# EasyEDA Pro project FD-MIE-B.eprj

# Schematic FD-MIE-B1
Create Date: 2025-06-20; Page Name: P1; Project Name: FD-MIE-B; Schematic Name: FD-MIE-B1; Update Date: 2025-06-23; Company: 嘉立创EDA; Page Size: A4; Version: V1.0
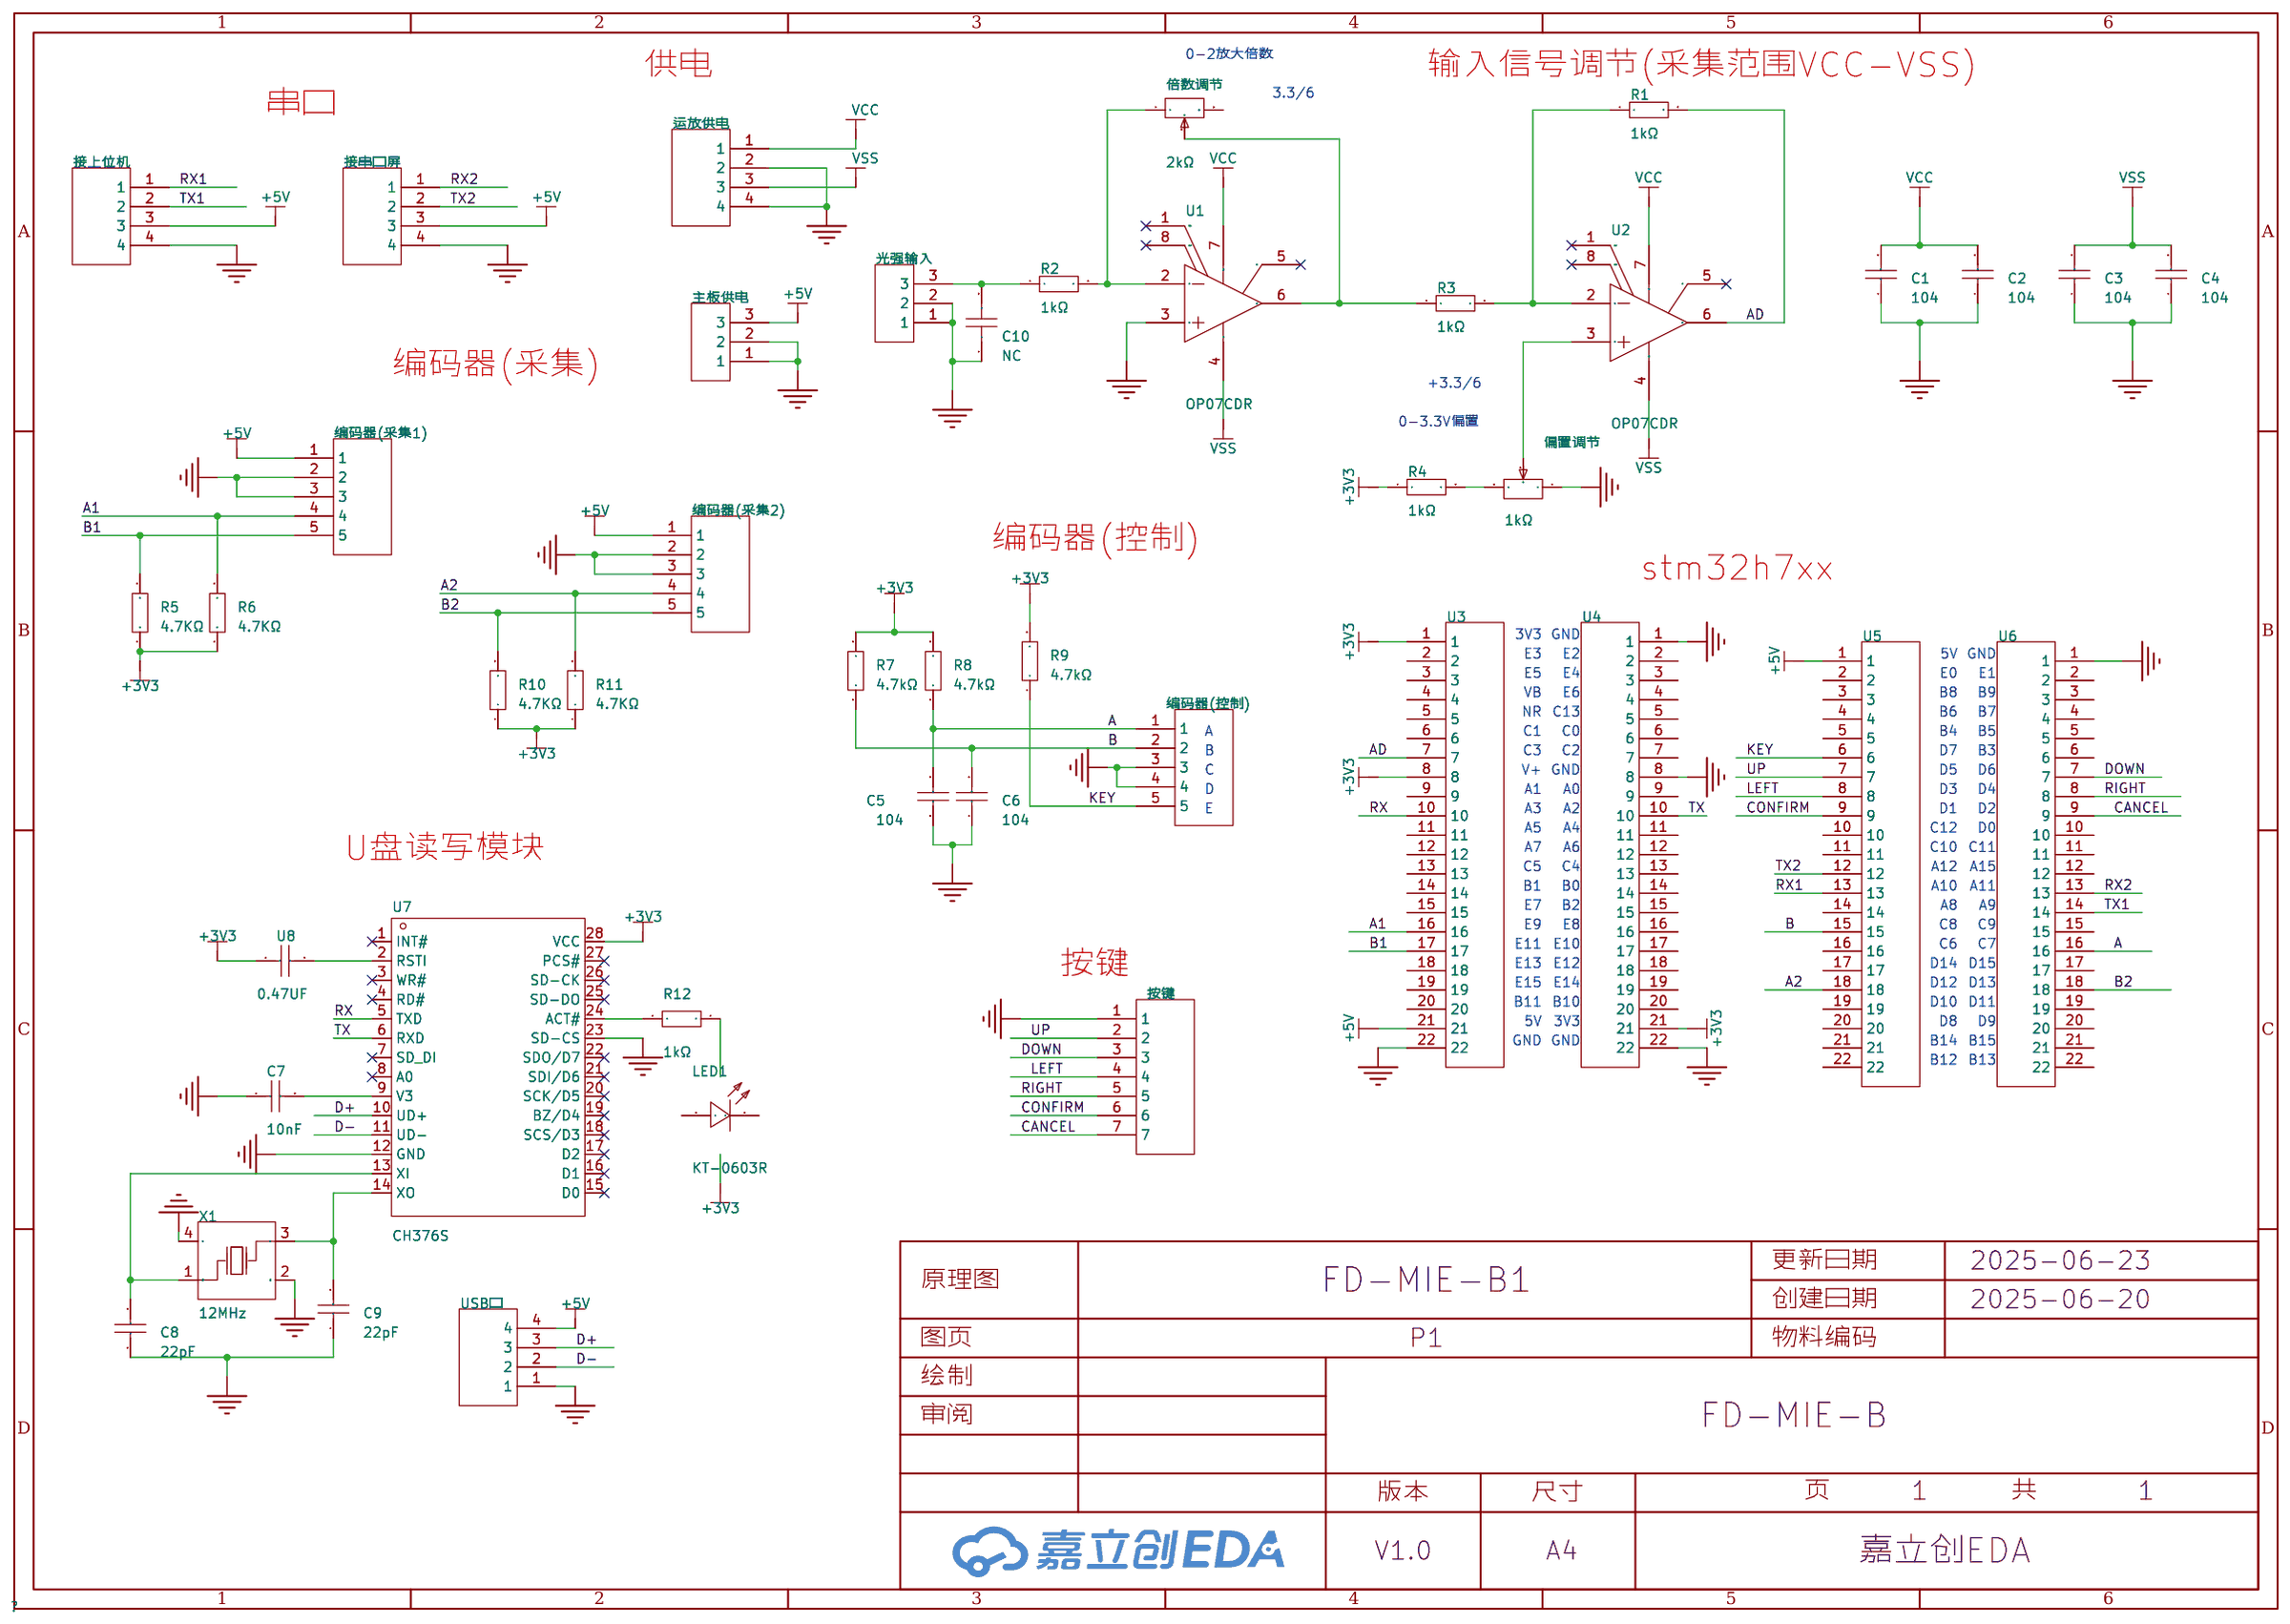
[diagram p0: schematic sheet]

## Parts
C1  104  [C0603]
C2  104  [C0603]
C3  104  [C0603]
C4  104  [C0603]
C5  104  [C0603]
C6  104  [C0603]
C7  10nF  [C0603]
C8  22pF  [C0603]
C9  22pF  [C0603]
C10  NC  [280*100mil]
LED1  KT-0603R  [LED0603-RD]
R1  1kΩ  [R0603]
R2  1kΩ  [R0603]
R3  1kΩ  [R0603]
R4  1kΩ  [R0603]
R5  4.7KΩ  [R0805]
R6  4.7KΩ  [R0805]
R7  4.7kΩ  [R0805]
R8  4.7kΩ  [R0805]
R9  4.7kΩ  [R0805]
R10  4.7KΩ  [R0805]
R11  4.7KΩ  [R0805]
R12  1kΩ  [R0603]
U1  OP07CDR  [SOIC-8_L4.9-W3.9-P1.27-LS6.0-BL]
U2  OP07CDR  [SOIC-8_L4.9-W3.9-P1.27-LS6.0-BL]
U3  -  [CH2.54-22P]
U4  -  [CH2.54-22P]
U5  -  [CH2.54-22P]
U6  -  [CH2.54-22P]
U7  CH376S  [SOIC-28_L17.9-W7.5-P1.27-LS10.3-BL]
U8  0.47UF  [C0603]
USB口  -  [CH2.54-4插座]
X1  12MHz  [CRYSTAL-SMD_4P-L3.2-W2.5-BL]
主板供电  -  [CH2.54-3插座]
倍数调节  2kΩ  [RES-ADJ-TH_3P-L9.5-W4.9-P2.50]
偏置调节  1kΩ  [RES-ADJ-TH_3P-L9.5-W4.9-P2.50]
光强输入  -  [CH2.54-3插座]
按键  -  [CH2.54-7插座]
接上位机  -  [CH2.54-4插座]
接串口屏  -  [CH2.54-4插座]
编码器(控制)  -  [CH2.54-5插座]
编码器(采集1)  -  [CH2.54-5插座]
编码器(采集2)  -  [CH2.54-5插座]
运放供电  -  [CH2.54-4插座]

## Library data of the parts
C1-C7 = 0603B103K500NT: 容值:10nF;精度:±10%;额定电压:50V;材质(温度系数):X7R;; LCSC Part Name: 10nF ±10% 50V; Supplier Part: C57112; Manufacturer: FH(风华); Supplier Footprint: 0603; JLCPCB Part Class: 基础库; Datasheet: https://atta.szlcsc.com/upload/public/pdf/source/20200305/C486355_26A10D38EF8C2A5C37091D0039909270.pdf; Supplier: LCSC; Tolerance: ±10%; Voltage Rated: 50V; Temperature Coefficient: X7R
C8 C9 = CL10C220JB8NNNC: 容值:22pF;精度:±5%;额定电压:50V;材质(温度系数):C0G;; LCSC Part Name: 22pF ±5% 50V; Supplier Part: C1653; Manufacturer: SAMSUNG(三星); Supplier Footprint: 0603; JLCPCB Part Class: 基础库; Datasheet: https://atta.szlcsc.com/upload/public/pdf/source/20160218/1457707763339.pdf; Supplier: LCSC; Tolerance: ±5%; Voltage Rated: 50V; Temperature Coefficient: C0G
C10 = 插件电容
LED1 = KT-0603R: 发光颜色:红色;功率:-;正向电流:-;主波长:-;二极管配置:-;透镜颜色:-;色温:-;发光角度:-;载带方式:-;工作温度:-40℃~+85℃;; LCSC Part Name: 0603 红灯 高亮; Supplier Part: C2286; Manufacturer: KENTO; Supplier Footprint: 0603; JLCPCB Part Class: 基础库; Datasheet: https://atta.szlcsc.com/upload/public/pdf/source/20160616/1466072038404.pdf; Supplier: LCSC; Emitted Color: 红色; Operating Temperature: -40℃~+85℃
R1-R4 = 0603WAF510KT5E: 电阻类型:厚膜电阻;阻值:5.1Ω;精度:±1%;功率:100mW;最大工作电压:75V;温度系数:±200ppm/℃;; LCSC Part Name: 5.1Ω ±1% 100mW 厚膜电阻; Supplier Part: C25197; Manufacturer: UNI-ROYAL(厚声); Supplier Footprint: 0603; JLCPCB Part Class: 基础库; Datasheet: https://atta.szlcsc.com/upload/public/pdf/source/20200306/C422600_1E6D84923E4A46A82E41ADD87F860B5C.pdf; Supplier: LCSC; Type: 厚膜电阻; Tolerance: ±1%; Power(Watts): 100mW; Overload Voltage (Max): 75V; Temperature Coefficient: ±200ppm/℃; Operating Temperature Range: -55℃~+155℃
R5-R11 = 0805W8F1002T5E_C17414: 电阻类型:厚膜电阻;阻值:10kΩ;精度:±1%;功率:125mW;最大工作电压:150V;温度系数:±100ppm/℃;; LCSC Part Name: 10kΩ ±1% 125mW 厚膜电阻; Supplier Part: C17414; Manufacturer: UNI-ROYAL(厚声); Manufacturer Part: 0805W8F1002T5E; Supplier Footprint: 0805; JLCPCB Part Class: 基础库; Datasheet: https://atta.szlcsc.com/upload/public/pdf/source/20200306/C422600_1E6D84923E4A46A82E41ADD87F860B5C.pdf; Supplier: LCSC; Type: 厚膜电阻; Tolerance: ±1%; Power(Watts): 125mW; Overload Voltage (Max): 150V; Temperature Coefficient: ±100ppm/℃; Operating Temperature Range: -55℃~+155℃
R12 = 0603WAF1001T5E: 电阻类型:厚膜电阻;阻值:1kΩ;精度:±1%;功率:100mW;最大工作电压:75V;温度系数:±100ppm/℃;; LCSC Part Name: 1kΩ ±1% 100mW 厚膜电阻; Supplier Part: C21190; Manufacturer: UNI-ROYAL(厚声); Supplier Footprint: 0603; JLCPCB Part Class: 基础库; Datasheet: https://atta.szlcsc.com/upload/public/pdf/source/20200306/C422600_1E6D84923E4A46A82E41ADD87F860B5C.pdf; Supplier: LCSC; Type: 厚膜电阻; Tolerance: ±1%; Power(Watts): 100mW; Overload Voltage (Max): 75V; Temperature Coefficient: ±100ppm/℃; Operating Temperature Range: -55℃~+155℃
U1 U2 = OP07CDR: 放大器数:单路;增益带宽积(GBP):600kHz;输入偏置电流(Ib):1.8nA;压摆率(SR):0.3V/us;轨到轨:-;; LCSC Part Name: 精密运算放大器; Supplier Part: C7433; Manufacturer: TI(德州仪器); Supplier Footprint: SOIC-8; JLCPCB Part Class: 基础库; Datasheet: http://www.ti.com/cn/lit/gpn/op07c; Supplier: LCSC; Number of Channels: 单路; Gain Bandwidth Product: 600kHz; Ib - Input Bias Current: 1.8nA; Slew Rate: 0.3V/us; Operating Temperature: 0℃~+70℃
U3-U6 = HDR-22P
U7 = CH376S: 应用功能:收发器;接口协议:USB 2.0;数据速率:12Mbps;; Supplier Part: C14166; Manufacturer: WCH(南京沁恒); Supplier Footprint: SOP-28-300mil; JLCPCB Part Class: 扩展库; Datasheet: https://atta.szlcsc.com/upload/public/pdf/source/20240313/780B8519D8DF2DCF0D579C39FFA4C063.pdf; Supplier: LCSC; Applications Function: 收发器; Protocol: USB 2.0; Supply Voltage: 3.3V；5V; Data Rate: 12Mbps
U8 = CAPCER0.47UF25VX7R0603: Supplier Part: C9900012837; JLCPCB Part Class: 扩展库; Supplier: LCSC
USB口 接上位机 接串口屏 运放供电 = HDR-4P
X1 = X322512MSB4SI: 晶振类型:贴片晶振;频率:12MHz;常温频差:±10ppm;外接负载电容:20pF;频率稳定度(全温):±20ppm;; LCSC Part Name: 12MHz ±10ppm 20pF; Supplier Part: C9002; Manufacturer: YXC(扬兴晶振); Supplier Footprint: SMD3225-4P; JLCPCB Part Class: 基础库; Datasheet: https://atta.szlcsc.com/upload/public/pdf/source/20240329/19D5F850207469550BEB00D7DFEDBC7A.pdf; Supplier: LCSC; Crystal Type: 贴片晶振; Normal temperature Frequency Tolerance: ±10ppm; External load capacitor: 20pF; Frequency Stability(Full temperature range): ±20ppm; Operating Temperature: -40℃~+85℃
主板供电 光强输入 = HDR-3P
倍数调节 偏置调节 = 环保 3296W-1-503LF: 阻值:-;功率:-;; LCSC Part Name: 50KΩ; Supplier Part: C5033; Supplier Footprint: VR-3296W; JLCPCB Part Class: 扩展库; Supplier: LCSC
按键 = HDR-7P
编码器(控制) 编码器(采集1) 编码器(采集2) = HDR-5P

## Nets
+3V3: LED1.2(A) R4.1 R5.1 R6.1 R7.2 R8.2 R9.2 R10.1 R11.1 U3.1 U3.8 U4.21 U7.28(VCC) U8.1
+5V: U3.21 U5.1 USB口.4 主板供电.3 接上位机.3 接串口屏.3 编码器(采集1).1 编码器(采集2).1
GND: C1.1 C2.1 C3.1 C4.1 C5.1 C6.1 C7.1 C8.1 C9.1 C10.1 U1.3(IN+) U3.22 U4.1 U4.8 U4.22 U6.1 U7.12(GND) U7.23(SD-CS) USB口.1 X1.2(GND) X1.4(GND) 主板供电.1 主板供电.2 偏置调节.1 光强输入.1 光强输入.2 按键.1 接上位机.4 接串口屏.4 编码器(控制).3 编码器(控制).4 编码器(采集1).2 编码器(采集1).3 编码器(采集2).2 编码器(采集2).3 运放供电.2 运放供电.4
VCC: C1.2 C2.2 U1.7(VCC+) U2.7(VCC+) 运放供电.1
VSS: C3.2 C4.2 U1.4(VCC-) U2.4(VCC-) 运放供电.3
A: C5.2 R8.1 U6.16 编码器(控制).1
A1: R6.2 U3.16 编码器(采集1).4
A2: R11.2 U5.18 编码器(采集2).4
AD: R1.2 U2.6(OUT) U3.7
B: C6.2 R7.1 U5.15 编码器(控制).2
B1: R5.2 U3.17 编码器(采集1).5
B2: R10.2 U6.18 编码器(采集2).5
CANCEL: U6.9 按键.7
CONFIRM: U5.9 按键.6
D+: U7.10(UD+) USB口.3
D-: U7.11(UD-) USB口.2
DOWN: U6.7 按键.3
KEY: R9.1 U5.6 编码器(控制).5
LEFT: U5.8 按键.4
RIGHT: U6.8 按键.5
RX: U3.10 U7.5(TXD)
RX1: U5.13 接上位机.1
RX2: U6.13 接串口屏.1
TX: U4.10 U7.6(RXD)
TX1: U6.14 接上位机.2
TX2: U5.12 接串口屏.2
UP: U5.7 按键.2
$2N1752: C10.2 R2.1 光强输入.3
$2N1754: R2.2 U1.2(IN-) 倍数调节.1
$2N1759: R3.1 U1.6(OUT) 倍数调节.2
$2N1764: R1.1 R3.2 U2.2(IN-)
$2N1773: R4.2 偏置调节.3
$2N2030: U2.3(IN+) 偏置调节.2
$2N4189: R12.1 U7.24(ACT#)
$2N4193: U7.2(RSTI) U8.2
$2N4205: C7.2 U7.9(V3)
$2N4208: C8.2 U7.13(XI) X1.1(OSC1)
$2N4209: C9.2 U7.14(XO) X1.3(OSC2)
$2N4231: LED1.1(K) R12.2

Not connected (* = marked no-connect by the designer): U1 1(OFFSET N1)* 5(NC)* 8(OFFSET N2)*; U2 1(OFFSET N1)* 5(NC)* 8(OFFSET N2)*; U3 2 3 4 5 6 9 11 12 13 14 15 18 19 20; U4 2 3 4 5 6 7 9 11 12 13 14 15 16 17 18 19 20; U5 2 3 4 5 10 11 14 16 17 19 20 21 22; U6 2 3 4 5 6 10 11 12 15 17 19 20 21 22; U7 1(INT#)* 3(WR#)* 4(RD#)* 7(SD_DI)* 8(A0)* 15(D0)* 16(D1)* 17(D2)* 18(SCS/D3)* 19(BZ/D4)* 20(SCK/D5)* 21(SDI/D6)* 22(SDO/D7)* 25(SD-DO)* 26(SD-CK)* 27(PCS#)*; 倍数调节 3

## Notes on the sheet
- 0-2放大倍数
- 供电
- 输入信号调节(采集范围VCC-VSS)
- 3.3/6
- 串口
- 编码器(采集)
- +3.3/6
- 0-3.3V偏置
- 编码器(控制)
- stm32h7xx
- 3V3
- E3
- E2
- GND
- 5V
- GND
- E5
- E4
- E0
- E1
- VB
- E6
- B8
- B9
- NR
- C13
- B6
- B7
- A
- C1
- C0
- B4
- B5
- B
- C
- C3
- V+
- C2
- GND
- D5
- D7
- B3
- D6
- D
- A1
- A0
- D3
- D4
- E
- A3
- A2
- D1
- D2
- A5
- A4
- C12
- D0
- U盘读写模块
- A7
- A6
- C10
- C11
- C5
- C4
- A12
- A15
- B1
- E7
- B0
- B2
- A10
- A8
- A11
- A9
- E9
- E8
- C8
- C9
- E11
- E10
- C6
- C7
- 按键
- E13
- E12
- D14
- D15
- E15
- E14
- D12
- D13
- 5V
- B11
- 3V3
- B10
- D10
- D8
- D11
- D9
- GND
- GND
- B14
- B15
- B12
- B13

# Board FD-MIE-B1
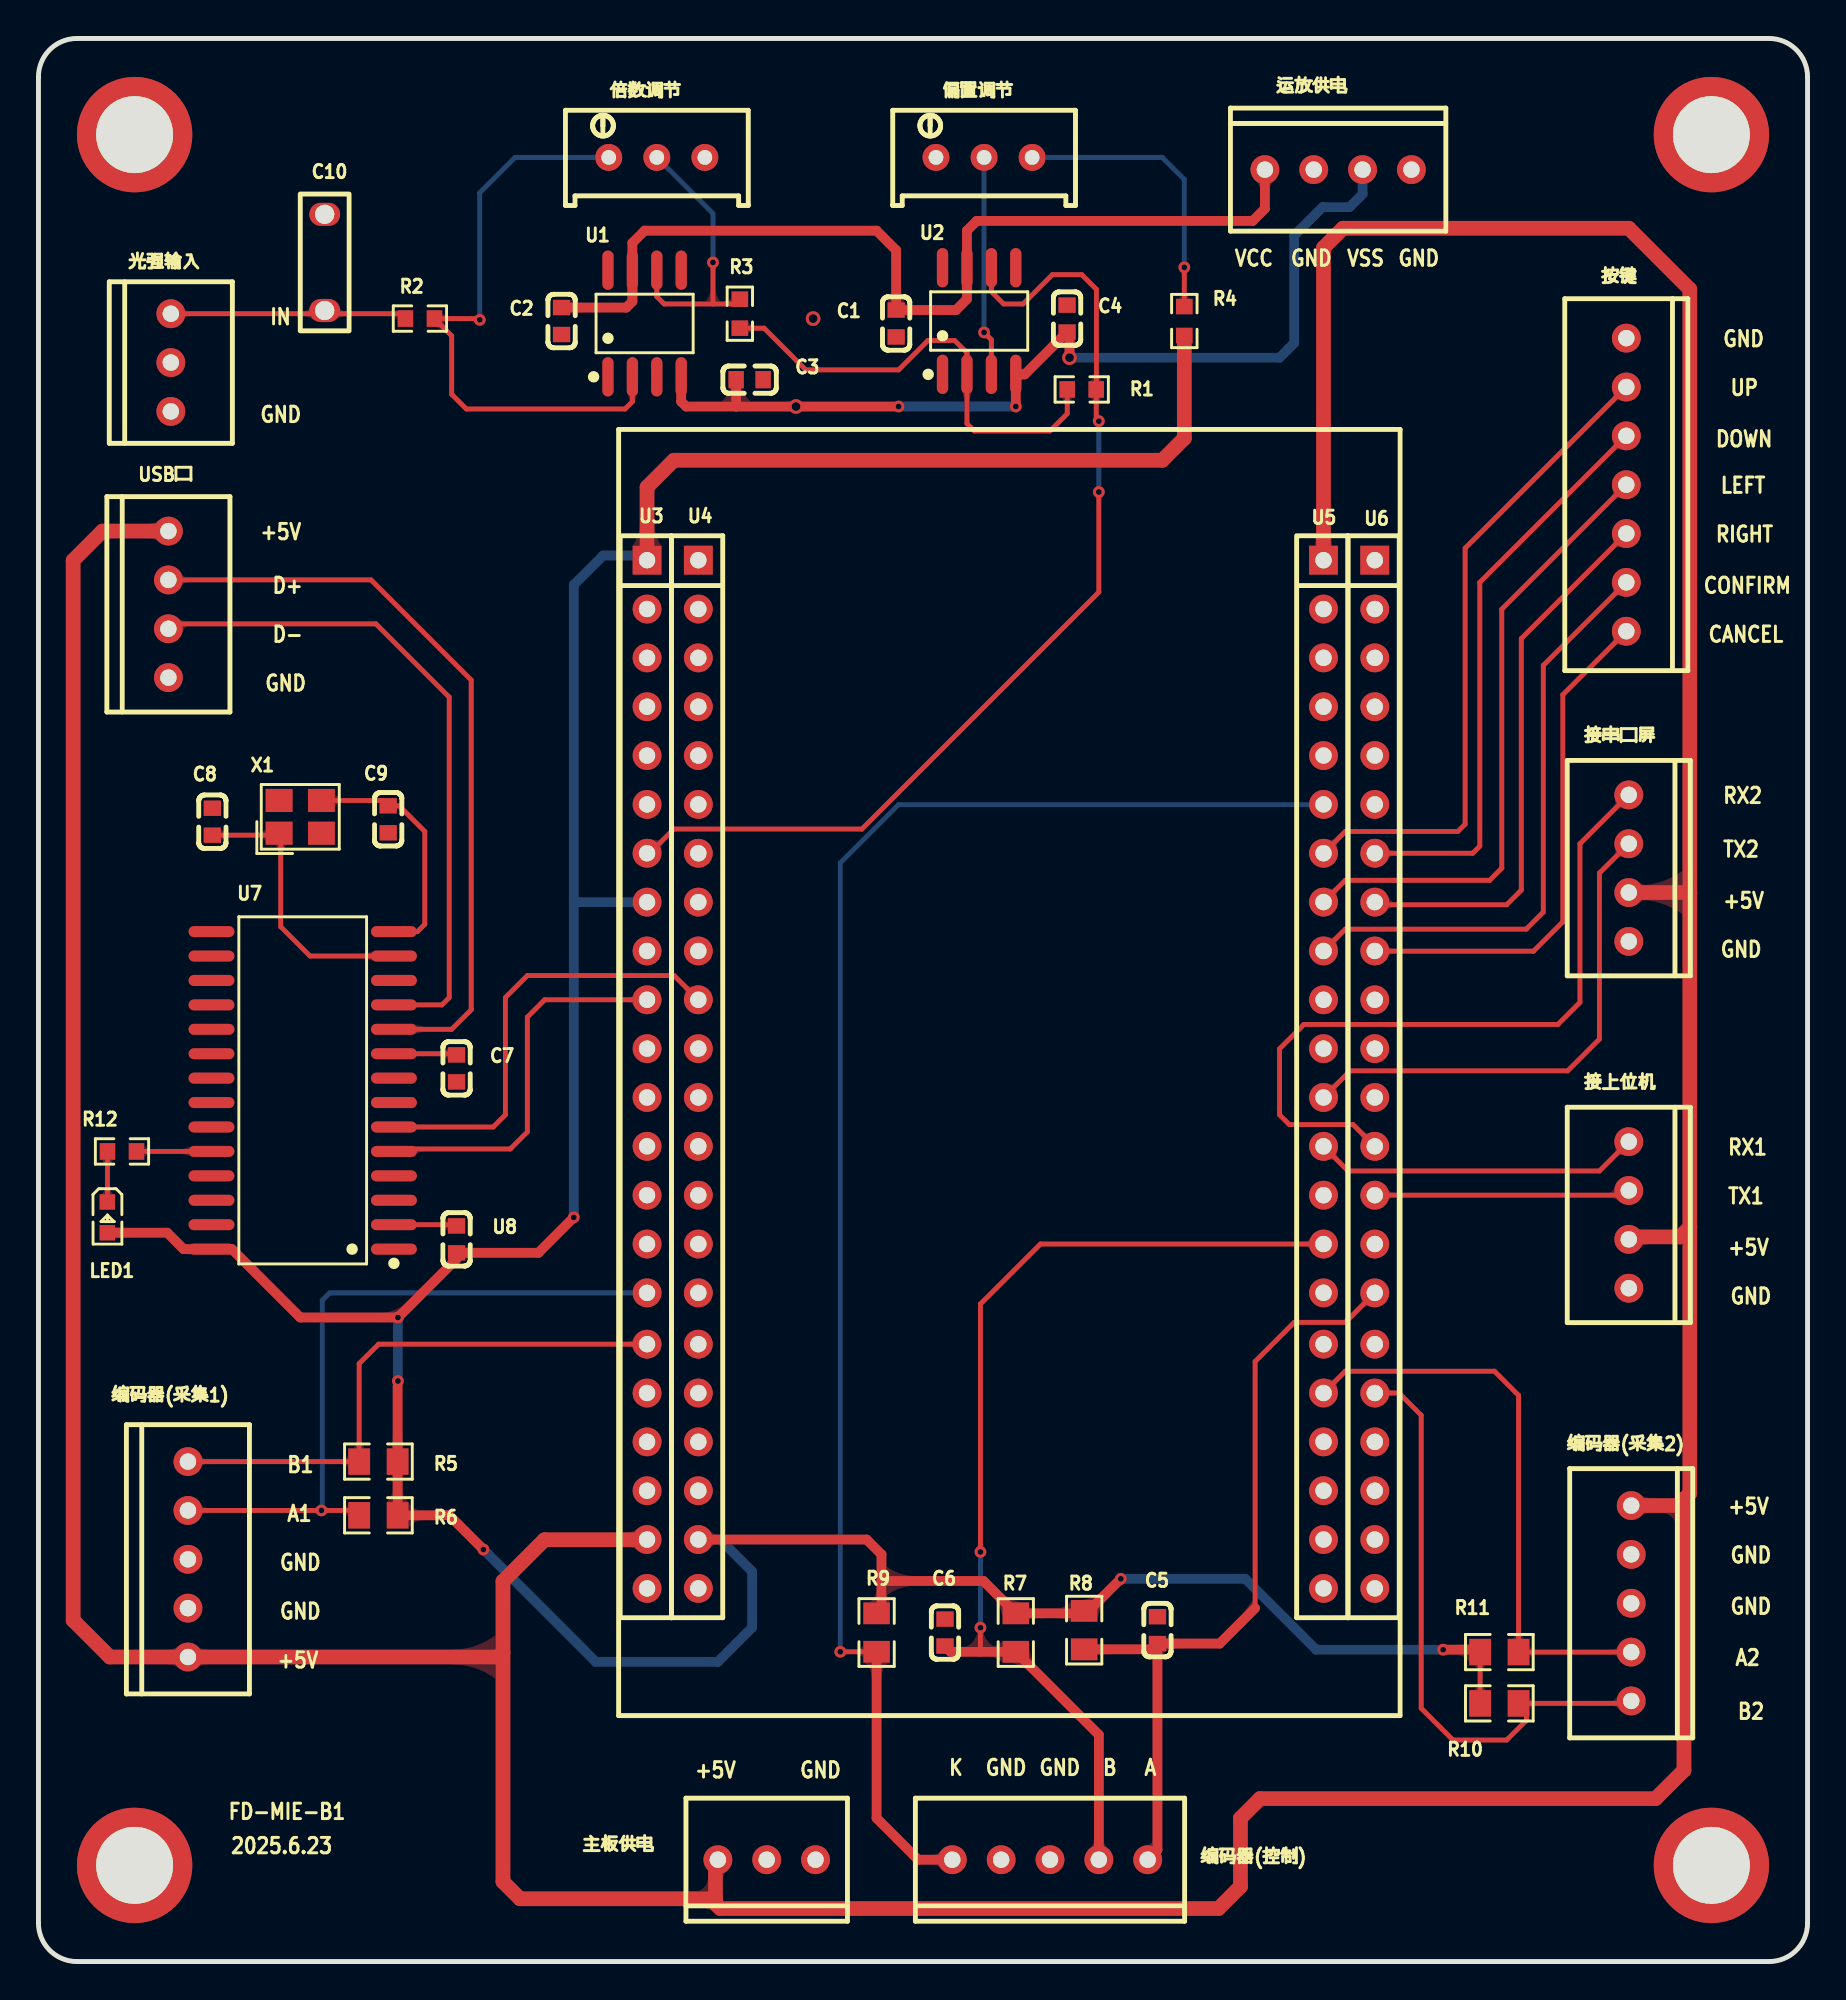
[diagram p1: board, top side]
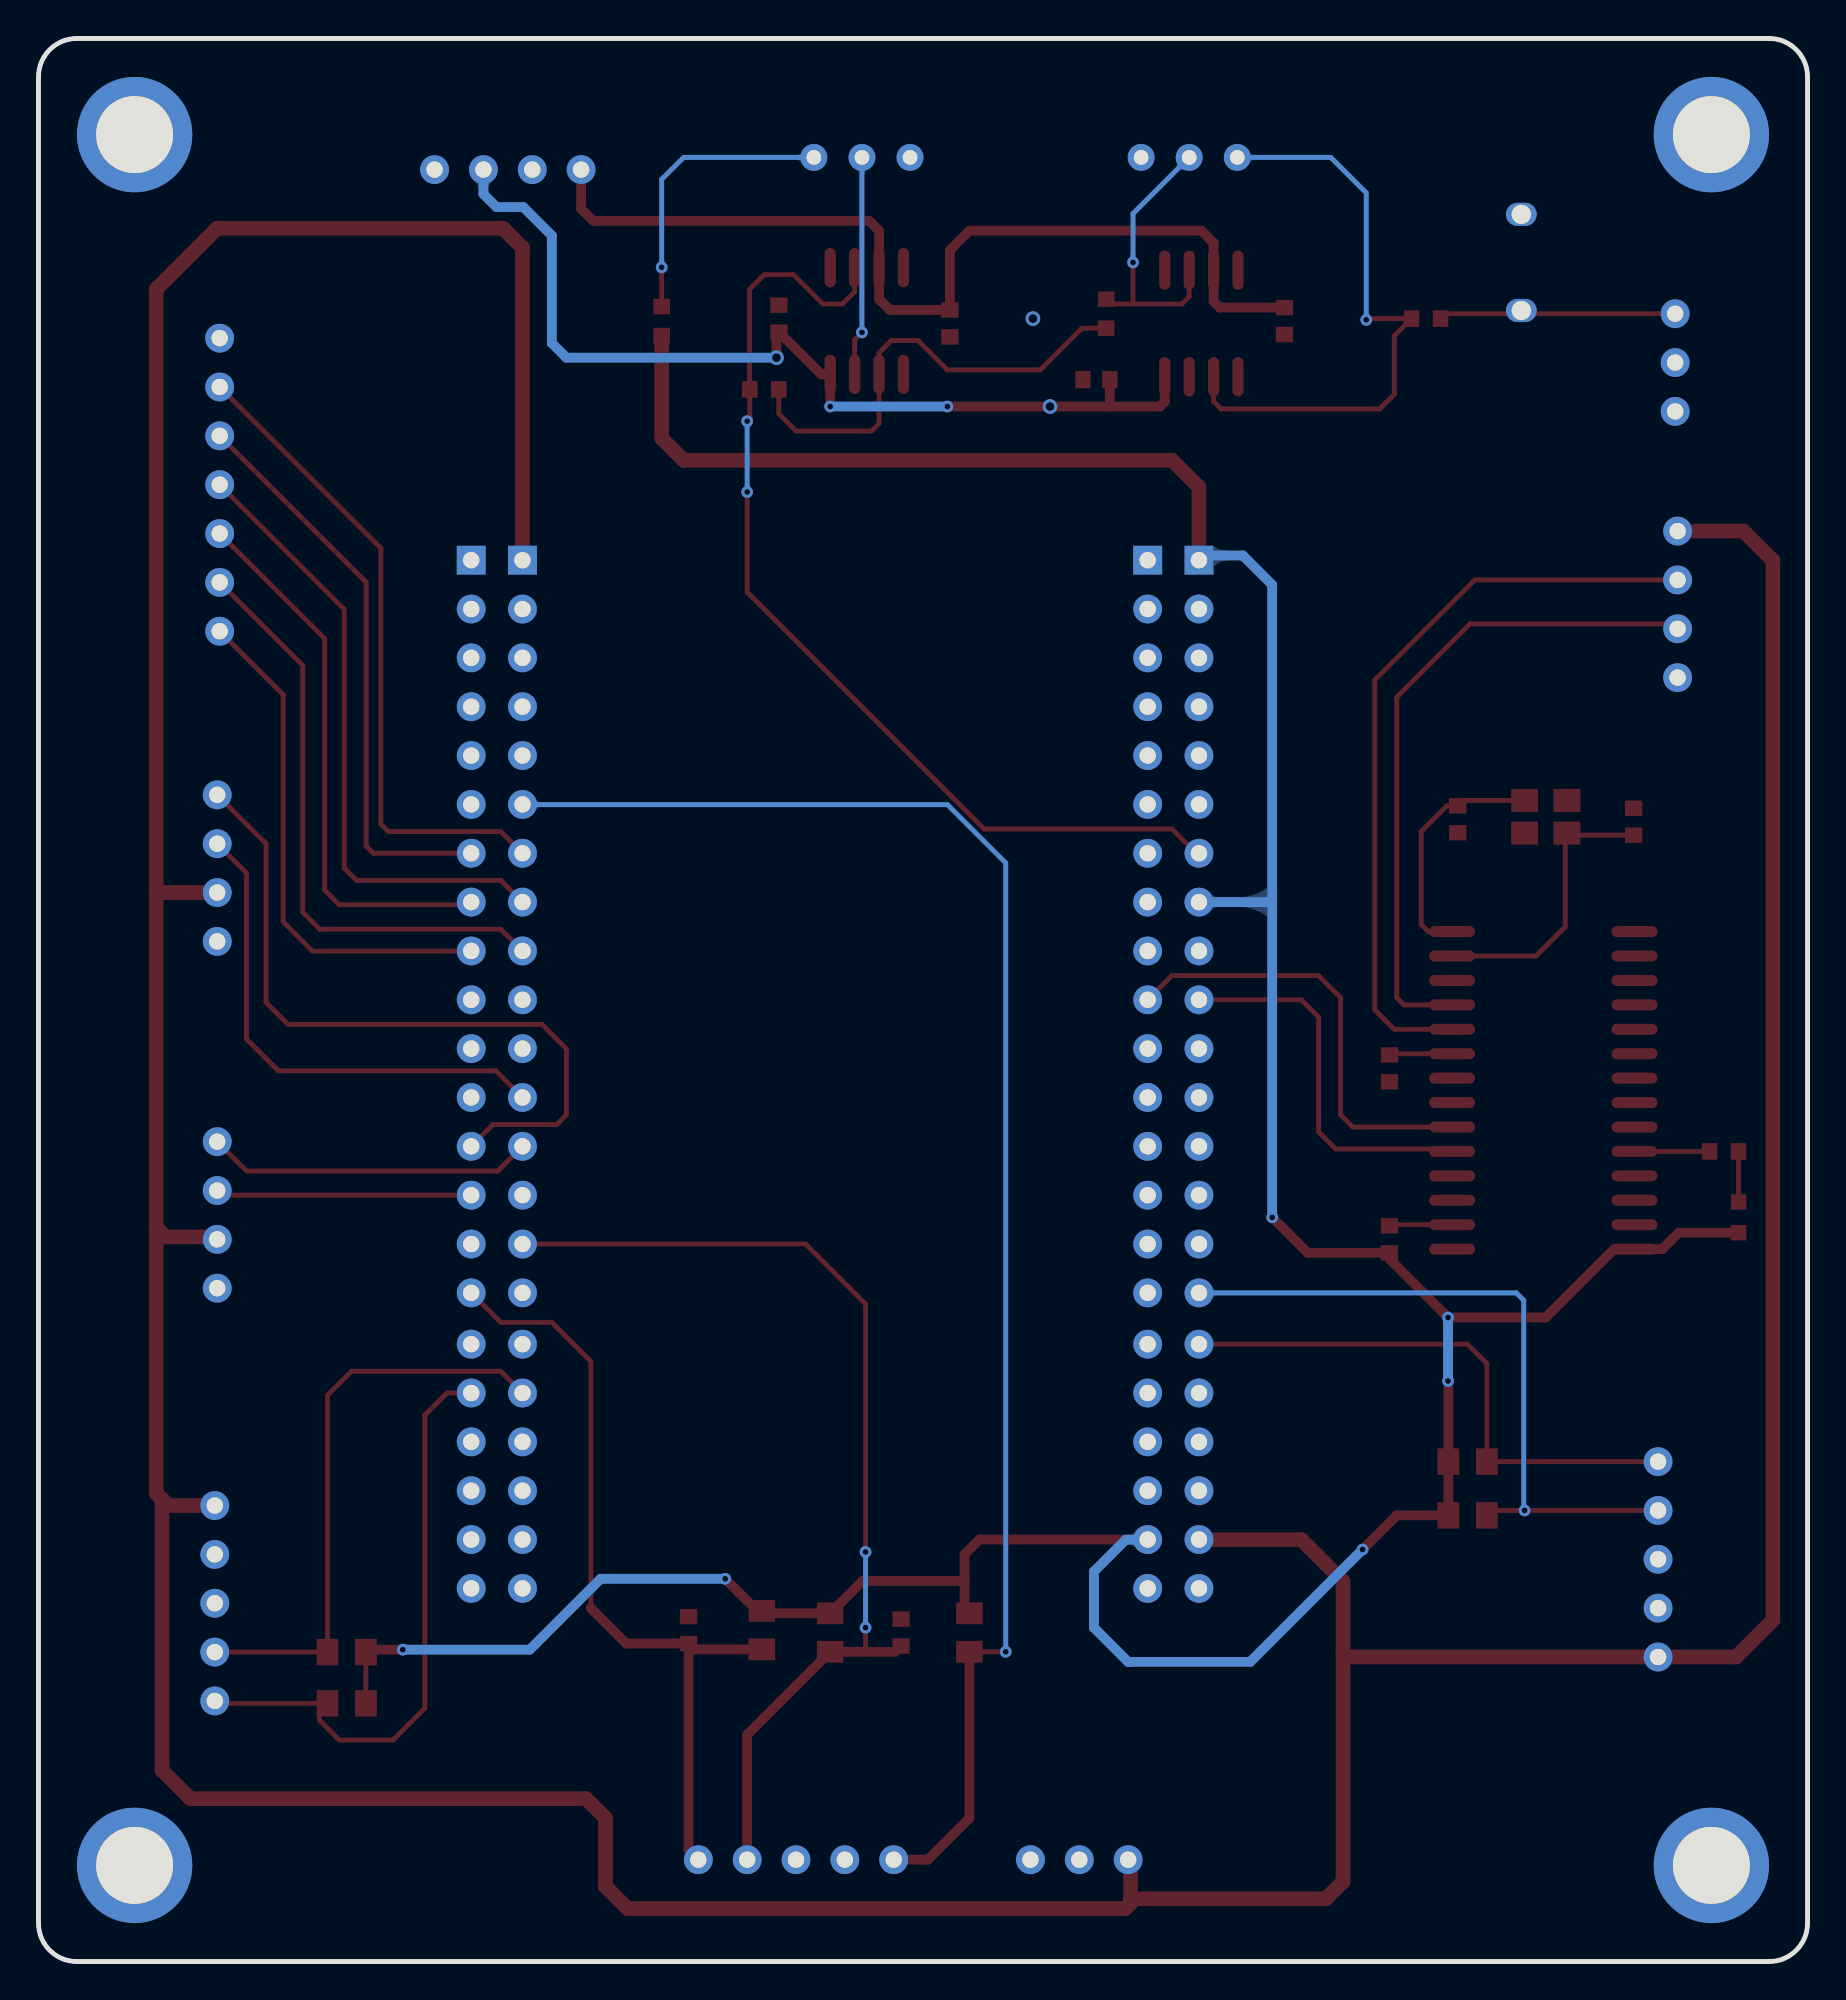
[diagram p2: board, bottom side, seen from below]

Outline 92 x 100 mm; copper layers: Top Layer, Bottom Layer. Coordinates in mm from the lower left corner of the outline.
Outline path: 0,98 0,2 arc(0.59,0.59) 2,0 90,0 arc(91.41,0.59) 92,2 92,98 arc(91.41,99.41) 90,100 2,100 arc(0.59,99.41) 0,98
Stack: Top Layer 0.035mm / Dielectric1 1.51mm FR4 er 4.5 / Bottom Layer 0.035mm

## Design rules (mm)
template: 自定义配置
spacing copperThickness1oz (default): track to track 0.102, other pairs 0.152 to 0.3
spacing copperThickness2oz: track to track 0.203, other pairs 0.152 to 0.3
track width copperThickness1oz (default): min 0.127, default 0.254, max 2.54
track width copperThickness2oz: min 0.203, default 0.254, max 2.54
track width VCCandGND: min 0.254, default 0.762, max 2.54
differential pair differentialPair (default): width min 0.127, default 0.254, max 2.54; gap min 0.152, default 0.152
via viaSize (default): diameter min 0.5, default 0.61, max 10; hole min 0.3, default 0.305, max 6.299
net +5V uses VCCandGND
net GND uses VCCandGND
net +3V3 uses VCCandGND

## Placement (name value [footprint] x y rotation side)
C1  104  [C0603]  44.6 85.18 90 top
C2  104  [C0603]  27.2 85.31 90 top
C3  104  [C0603]  36.98 82.26 180 top
C4  104  [C0603]  53.49 85.43 270 top
C5  104  [C0603]  58.19 17.23 270 top
C6  104  [C0603]  47.14 17.11 270 top
C7  10nF  [C0603]  21.74 46.44 90 top
C8  22pF  [C0603]  9.04 59.27 270 top
C9  22pF  [C0603]  18.19 59.4 90 top
C10  NC  [280*100mil]  14.89 88.35 270 top
LED1  KT-0603R  [LED0603-RD]  3.58 38.7 270 top
NOREF  -  [Pad_e145]  5 5 0 top
NOREF#2  -  [Pad_e143]  5 95 0 top
NOREF#3  -  [Pad_e146]  87 5 0 top
NOREF#4  -  [Pad_e144]  87 95 0 top
R1  1kΩ  [R0603]  54.25 81.75 0 top
R2  1kΩ  [R0603]  19.84 85.43 0 top
R3  1kΩ  [R0603]  36.47 85.69 270 top
R4  1kΩ  [R0603]  59.59 85.31 90 top
R5  4.7KΩ  [R0805]  17.68 26 180 top
R6  4.7KΩ  [R0805]  17.68 23.2 180 top
R7  4.7kΩ  [R0805]  50.83 17.11 90 top
R8  4.7kΩ  [R0805]  54.38 17.23 90 top
R9  4.7kΩ  [R0805]  43.59 17.11 90 top
R10  4.7KΩ  [R0805]  75.97 13.42 0 top
R11  4.7KΩ  [R0805]  75.97 16.09 0 top
R12  1kΩ  [R0603]  4.34 42.13 180 top
U1  OP07CDR  [SOIC-8_L4.9-W3.9-P1.27-LS6.0-BL]  31.52 85.18 0 top
U2  OP07CDR  [SOIC-8_L4.9-W3.9-P1.27-LS6.0-BL]  48.92 85.31 0 top
U3  -  [CH2.54-22P]  31.52 46.19 270 top
U4  -  [CH2.54-22P]  34.19 46.19 270 top
U5  -  [CH2.54-22P]  66.7 46.19 270 top
U6  -  [CH2.54-22P]  69.37 46.19 270 top
U7  CH376S  [SOIC-28_L17.9-W7.5-P1.27-LS10.3-BL]  13.74 45.3 90 top
U8  0.47UF  [C0603]  21.74 37.55 90 top
USB口  -  [CH2.54-4插座]  6.76 70.57 90 top
X1  12MHz  [CRYSTAL-SMD_4P-L3.2-W2.5-BL]  13.61 59.53 0 top
主板供电  -  [CH2.54-3插座]  37.87 5.3 180 top
倍数调节  2kΩ  [RES-ADJ-TH_3P-L9.5-W4.9-P2.50]  32.16 93.81 90 top
偏置调节  1kΩ  [RES-ADJ-TH_3P-L9.5-W4.9-P2.50]  49.18 93.81 90 top
光强输入  -  [CH2.54-3插座]  6.88 83.15 90 top
按键  -  [CH2.54-7插座]  82.58 76.8 270 top
接上位机  -  [CH2.54-4插座]  82.7 38.82 270 top
接串口屏  -  [CH2.54-4插座]  82.7 56.86 270 top
编码器(控制)  -  [CH2.54-5插座]  52.6 5.3 180 top
编码器(采集1)  -  [CH2.54-5插座]  7.77 20.92 90 top
编码器(采集2)  -  [CH2.54-5插座]  82.83 18.63 270 top
运放供电  -  [CH2.54-4插座]  67.59 93.18 0 top

## Footprints (pads in the part's own frame, mm; a bottom-side part is the same pattern mirrored in y, then rotated)
280*100mil
  oval 1.2x1.6 hole 1x0.8: 1(-2.5,0) 2(2.5,0)
C0603
  rect 0.8x0.9 smd: 1(-0.7,0) 2(0.7,0)
CH2.54-3插座
  round 1.5 hole 0.85: 1(-2.54,0) 2(0,0) 3(2.54,0)
CH2.54-4插座
  round 1.5 hole 0.85: 1(-3.81,0) 2(-1.27,0) 3(1.27,0) 4(3.81,0)
CH2.54-5插座
  round 1.5 hole 0.85: 1(-5.08,0) 2(-2.54,0) 3(0,0) 4(2.54,0) 5(5.08,0)
CH2.54-7插座
  round 1.5 hole 0.85: 1(-7.62,0) 2(-5.08,0) 3(-2.54,0) 4(0,0) 5(2.54,0) 6(5.08,0) 7(7.62,0)
CH2.54-22P
  rect 1.5x1.5 hole 0.85: 1(-26.681,0.127)
  round 1.5 hole 0.85: 2(-24.141,0.127) 3(-21.601,0.127) 4(-19.061,0.127) 5(-16.521,0.127) 6(-13.981,0.127) 7(-11.441,0.127) 8(-8.901,0.127) 9(-6.361,0.127) 10(-3.821,0.127) 11(-1.281,0.127) 12(1.259,0.127) 13(3.799,0.127) 14(6.339,0.127) 15(8.879,0.127) 16(11.419,0.127) 17(14.086,0.127) 18(16.626,0.127) 19(19.166,0.127) 20(21.706,0.127) 21(24.246,0.127) 22(26.786,0.127)
CRYSTAL-SMD_4P-L3.2-W2.5-BL
  rect 1.4x1.2 smd: 1(-1.1,-0.85) 2(1.1,-0.85) 3(1.1,0.85) 4(-1.1,0.85)
LED0603-RD
  rect 0.8x0.8 smd: 1(-0.799,0) 2(0.799,0)
Pad_e143
  round 6 hole 4: 1(0,0)
Pad_e144
  round 6 hole 4: 1(0,0)
Pad_e145
  round 6 hole 4: 1(0,0)
Pad_e146
  round 6 hole 4: 1(0,0)
R0603
  rect 0.806x0.864 smd: 1(-0.753,0) 2(0.753,0)
R0805
  rect 1.133x1.377 smd: 1(-1,0) 2(1,0)
RES-ADJ-TH_3P-L9.5-W4.9-P2.50
  round 1.4 hole 0.762: 1(0,2.5) 2(0,0) 3(0,-2.5)
SOIC-8_L4.9-W3.9-P1.27-LS6.0-BL
  oval 0.588x2.045 smd: 1(-1.905,-2.772) 2(-0.635,-2.772) 3(0.635,-2.772) 4(1.905,-2.772) 5(1.905,2.772) 6(0.635,2.772) 7(-0.635,2.772) 8(-1.905,2.772)
SOIC-28_L17.9-W7.5-P1.27-LS10.3-BL
  oval 0.574x2.388 smd: 1(-8.255,-4.744) 2(-6.985,-4.744) 3(-5.715,-4.744) 4(-4.445,-4.744) 5(-3.175,-4.744) 6(-1.905,-4.744) 7(-0.635,-4.744) 8(0.635,-4.744) 9(1.905,-4.744) 10(3.175,-4.744) 11(4.445,-4.744) 12(5.715,-4.744) 13(6.985,-4.744) 14(8.255,-4.744) 15(8.255,4.744) 16(6.985,4.744) 17(5.715,4.744) 18(4.445,4.744) 19(3.175,4.744) 20(1.905,4.744) 21(0.635,4.744) 22(-0.635,4.744) 23(-1.905,4.744) 24(-3.175,4.744) 25(-4.445,4.744) 26(-5.715,4.744) 27(-6.985,4.744) 28(-8.255,4.744)

## Nets
As in the schematic, except:
GND: C1.1 C2.1 C3.1 C4.1 C5.1 C6.1 C7.1 C8.1 C9.1 C10.1 NOREF.1 NOREF#2.1 NOREF#3.1 NOREF#4.1 U1.3 U3.22 U4.1 U4.8 U4.22 U6.1 U7.12 U7.23 USB口.1 X1.2 X1.4 主板供电.1 主板供电.2 偏置调节.1 光强输入.1 光强输入.2 按键.1 接上位机.4 接串口屏.4 编码器(控制).3 编码器(控制).4 编码器(采集1).2 编码器(采集1).3 编码器(采集2).2 编码器(采集2).3 运放供电.2 运放供电.4

Pads without a net: U1 1 5 8; U2 1 5 8; U3 2 3 4 5 6 9 11 12 13 14 15 18 19 20; U4 2 3 4 5 6 7 9 11 12 13 14 15 16 17 18 19 20; U5 2 3 4 5 10 11 14 16 17 19 20 21 22; U6 2 3 4 5 6 10 11 12 15 17 19 20 21 22; U7 1 3 4 7 8 15 16 17 18 19 20 21 22 25 26 27; 倍数调节 3

## Via types
v1: diameter 0.762, hole 0.457, Top Layer to Bottom Layer, 3 vias
v2: diameter 0.61, hole 0.305, Top Layer to Bottom Layer, 18 vias

## Routing (per net, layer and track width the routed paths; a pad name or vN(x,y) marks a point on that pad's centre or on a via; arc(x,y) is an arc through that point)
+3V3: length 196.4
  Top Layer w0.254: R11.1 R10.1
  Top Layer w0.508: 43.84,19.79 43.84,18.36 R9.2 ; 43.84,19.79 43.84,21.17 43.07,21.94 U4.21 ; 43.84,19.79 49.14,19.79 R7.2 54.25,18.11 R8.2 54.62,18.23 v2(56.29,19.9) ; v2(23.14,21.43) 21.36,23.2 R6.1 R5.1 18.68,29.93 ; v2(27.84,38.7) 26,36.85 U8.1 21.74,36.54 v2(18.69,33.49) 13.61,33.49 10.06,37.05 U7.28 7.55,37.05 6.7,37.9 LED1.2 ; R11.1 74.84,16.22 v2(73.05,16.22)
  Top Layer w0.762: R4.1 59.59,79.21 58.45,78.07 33.05,78.07 31.65,76.67 U3.1
  Bottom Layer w0.508: v2(23.14,21.43) 28.98,15.58 35.33,15.58 37.11,17.36 37.11,20.28 35.46,21.93 34.33,21.93 U4.21 ; 27.84,55.08 v2(27.84,38.7) ; 27.84,55.08 27.84,71.59 29.36,73.11 31.41,73.11 U3.1 ; 27.84,55.08 27.85,55.09 U3.8 ; v2(56.29,19.9) 62.76,19.9 66.45,16.22 v2(73.05,16.22) ; v2(18.69,30.19) v2(18.69,33.49)
+5V: length 301.1
  Top Layer w0.762: 85.88,55.57 85.86,55.59 接串口屏.3 ; 85.88,55.57 85.88,38.19 ; 85.88,55.57 85.88,86.96 82.7,90.13 67.84,90.13 66.83,89.12 U5.1 ; 85.88,38.19 85.88,24.35 85.57,24.04 ; 85.88,38.19 85.37,37.68 82.83,37.68 接上位机.3 ; U3.21 31.64,21.93 26.31,21.93 24.16,19.77 24.16,16.06 ; 24.16,16.06 24.16,4.15 25.04,3.26 35.21,3.26 ; 24.16,16.06 23.93,15.84 编码器(采集1).1 3.71,15.84 1.8,17.74 1.8,72.86 3.33,74.38 USB口.4 ; 85.57,24.04 85.57,9.94 84.1,8.47 63.53,8.47 62.51,7.46 62.51,3.9 61.37,2.76 35.46,2.76 35.21,3.01 35.21,3.26 ; 85.57,24.04 85.24,23.71 编码器(采集2).1 ; 35.21,3.26 35.21,5.55
GND:
  vias: v1(40.28,85.43)
VCC: length 49.8
  Top Layer w0.508: 运放供电.1 63.78,91.15 63.15,90.51 48.79,90.51 48.29,90 U2.7 48.29,86.45 47.72,85.88 C1.2 44.6,88.99 43.59,90 31.52,90 30.89,89.37 U1.7 30.89,86.32 30.57,86.01 C2.2
VSS: length 50.1
  Top Layer w0.508: 36.28,80.86 33.68,80.86 33.43,81.11 U1.4 ; 36.28,80.86 v1(39.4,80.86) v2(44.73,80.86) ; 36.28,80.86 C3.2 ; v1(53.62,83.4) 53.62,84.61 C4.2 51.29,82.53 U2.4 v2(50.83,80.86)
  Bottom Layer w0.508: v2(50.83,80.86) v2(44.73,80.86) ; v1(53.62,83.4) 64.54,83.4 65.3,84.16 65.3,89.75 66.79,91.23 68.18,91.23 68.86,91.91 运放供电.3
A: length 41.8
  Top Layer w0.254: U6.16 67.96,33.24 65.3,33.24 63.27,31.2 63.27,18.38
  Top Layer w0.508: 编码器(控制).1 58.19,5.8 C5.2 ; C5.2 61.43,16.53 63.27,18.38 ; C5.2 57.89,16.23 R8.1
A1: length 37
  Top Layer w0.254: 编码器(采集1).4 v2(14.72,23.46) 16.42,23.46 R6.2
  Bottom Layer w0.254: 14.76,23.46 14.76,34.38 15.15,34.77 U3.16
A2: length 30.3
  Top Layer w0.254: U5.18 67.96,30.7 75.72,30.7 76.97,29.44 R11.2 编码器(采集2).4
AD: length 52.8
  Top Layer w0.254: v2(55.14,76.42) 55.14,71.21 42.82,58.89 33.05,58.89 31.79,57.63 U3.7 ; v2(55.14,80.1) 55.01,80.23 R1.2 55.02,81.76 55.02,86.96 54.25,87.72 52.73,87.72 51.21,86.19 50.19,86.19 49.56,86.83 U2.6
  Bottom Layer w0.254: v2(55.14,76.42) v2(55.14,80.1)
B: length 53.6
  Top Layer w0.254: U5.15 52.11,37.31 48.99,34.19 v2(48.99,21.3) ; 48.99,16.11 v2(48.99,17.36)
  Top Layer w0.508: 编码器(控制).2 55.14,11.79 R7.1 47.44,16.11 C6.2
  Bottom Layer w0.254: v2(48.99,17.36) v2(48.99,21.3)
B1: length 29.4
  Top Layer w0.254: 编码器(采集1).5 R5.2 16.68,31.09 17.69,32.1 U3.17
B2: length 31.5
  Top Layer w0.254: 77.38,13.42 R10.2 ; 77.38,13.42 82.7,13.42 编码器(采集2).5 ; 77.38,13.42 77.38,12.55 76.35,11.52 73.56,11.52 71.91,13.17 71.91,28.41 70.75,29.56 U6.18
CANCEL: length 26.9
  Top Layer w0.254: U6.9 69.51,52.54 77.75,52.54 79.27,54.06 79.27,65.88 按键.7
CONFIRM: length 31.2
  Top Layer w0.254: 按键.6 78.26,67.4 78.26,54.57 77.37,53.68 67.96,53.68 U5.9
D+: length 39.5
  Top Layer w0.254: USB口.3 17.3,71.84 22.5,66.64 22.5,49.49 21.49,48.48 U7.10
D-: length 34.9
  Top Layer w0.254: USB口.2 7.01,69.56 17.55,69.56 21.36,65.75 21.36,50.13 20.98,49.75 U7.11
DOWN: length 30.1
  Top Layer w0.254: U6.7 74.59,57.63 74.96,58 74.96,71.72 按键.3
KEY: length 82.8
  Top Layer w0.254: R9.1 v2(41.7,16.11) 41.68,16.09
  Top Layer w0.508: 编码器(控制).5 45.75,5.3 43.59,7.46 R9.1
  Bottom Layer w0.254: 66.83,60.17 66.82,60.16 44.73,60.16 41.7,57.13 v2(41.7,16.11)
LEFT: length 32.6
  Top Layer w0.254: U5.8 67.96,56.22 75.46,56.22 76.1,56.86 76.1,70.32 按键.4
RIGHT: length 28.8
  Top Layer w0.254: U6.8 69.63,54.95 76.35,54.95 77.12,55.72 77.12,68.8 按键.5
RX: length 19.9
  Top Layer w0.254: U7.5 18.61,42.25 24.54,42.25 25.43,43.14 25.43,49.11 26.33,50.01 U3.10
RX1: length 17
  Top Layer w0.254: 接上位机.1 81.18,41.11 68.11,41.11 66.83,42.39
RX2: length 37.5
  Top Layer w0.254: 接串口屏.1 80.16,58.13 80.16,49.87 79.02,48.73 65.81,48.73 64.54,47.46 64.54,44.03 65.05,43.52 68.36,43.52 69.5,42.39
TX: length 23.2
  Top Layer w0.254: U4.10 33.06,51.27 25.43,51.27 24.28,50.13 24.28,44.03 23.65,43.4 U7.6
TX1: length 13.3
  Top Layer w0.254: U6.14 82.46,39.85 接上位机.2
TX2: length 26.4
  Top Layer w0.254: 接串口屏.2 81.18,56.6 81.18,47.97 79.53,46.32 68.21,46.32 U5.12
UP: length 34.2
  Top Layer w0.254: 按键.2 74.19,73.5 74.19,59.14 73.81,58.76 67.96,58.76 U5.7
$2N1752: length 12.3
  Top Layer w0.254: 光强输入.3 18.83,85.69 R2.1
$2N1754: length 32
  Top Layer w0.254: U1.2 30.89,81.11 30.51,80.73 22.25,80.73 21.49,81.5 21.49,84.54 R2.2 22.89,85.43 23.01,85.31
  Bottom Layer w0.254: v2(22.95,85.37) 22.95,91.97 24.79,93.81 倍数调节.1
$2N1759: length 14.8
  Top Layer w0.254: 35.08,86.19 36.23,86.19 R3.1 ; 35.08,86.19 v2(35.08,88.35) ; 35.08,86.19 32.54,86.19 32.16,86.58 U1.6
  Bottom Layer w0.254: v2(35.08,88.35) 35.08,90.89 倍数调节.2
$2N1764: length 24.3
  Top Layer w0.254: R3.2 37.74,84.93 39.9,82.77 44.73,82.77 46.25,84.29 47.65,84.29 48.29,83.66 U2.2 48.29,79.97 48.67,79.59 52.6,79.59 53.5,80.49 R1.1
$2N1773: length 15
  Top Layer w0.254: R4.2 v2(59.59,88.1)
  Bottom Layer w0.254: v2(59.59,88.1) 59.59,92.67 58.45,93.81 偏置调节.3
$2N2030: length 11.2
  Top Layer w0.254: v2(49.18,84.71) 49.56,84.33 U2.3
  Bottom Layer w0.254: 偏置调节.2 49.18,84.92
$2N4189: length 3.9
  Top Layer w0.254: R12.1 U7.24
$2N4193: length 3.3
  Top Layer w0.254: U7.2 21.68,38.32 U8.2
$2N4205: length 3.3
  Top Layer w0.254: U7.9 21.68,47.21 C7.2
$2N4208: length 14.9
  Top Layer w0.254: C8.2 12.41,58.57 X1.1 12.6,58.59 12.6,53.81 14.12,52.29 U7.13
$2N4209: length 12.6
  Top Layer w0.254: U7.14 19.71,53.56 20.09,53.94 20.09,58.76 18.76,60.1 C9.2 17.91,60.38 14.72,60.38
$2N4231: length 2.6
  Top Layer w0.254: LED1.1 3.59,39.5 R12.2

## Copper pours and planes (outline as drawn; the poured copper is in the pictures)
GND on Top Layer: -13.69,-6.9 97.69,-6.9 97.69,106.9 -13.69,106.9
GND on Bottom Layer: -15.21,104.99 110.26,104.99 110.26,-5.63 -15.21,-5.63

Small or netless copper shapes (teardrops, artwork), in the pictures only: 155 on Top Layer, 22 on Bottom Layer

## Text on the board
Top Silkscreen Layer: FD-MIE-B1 | 2025.6.23 | GND | +5V | IN | D+ | D- | B1 | A1 | K | B | A | VCC | VSS | CONFIRM | CANCEL | DOWN | RIGHT | LEFT | RX2 | TX2 | RX1 | TX1 | UP | A2 | B2
